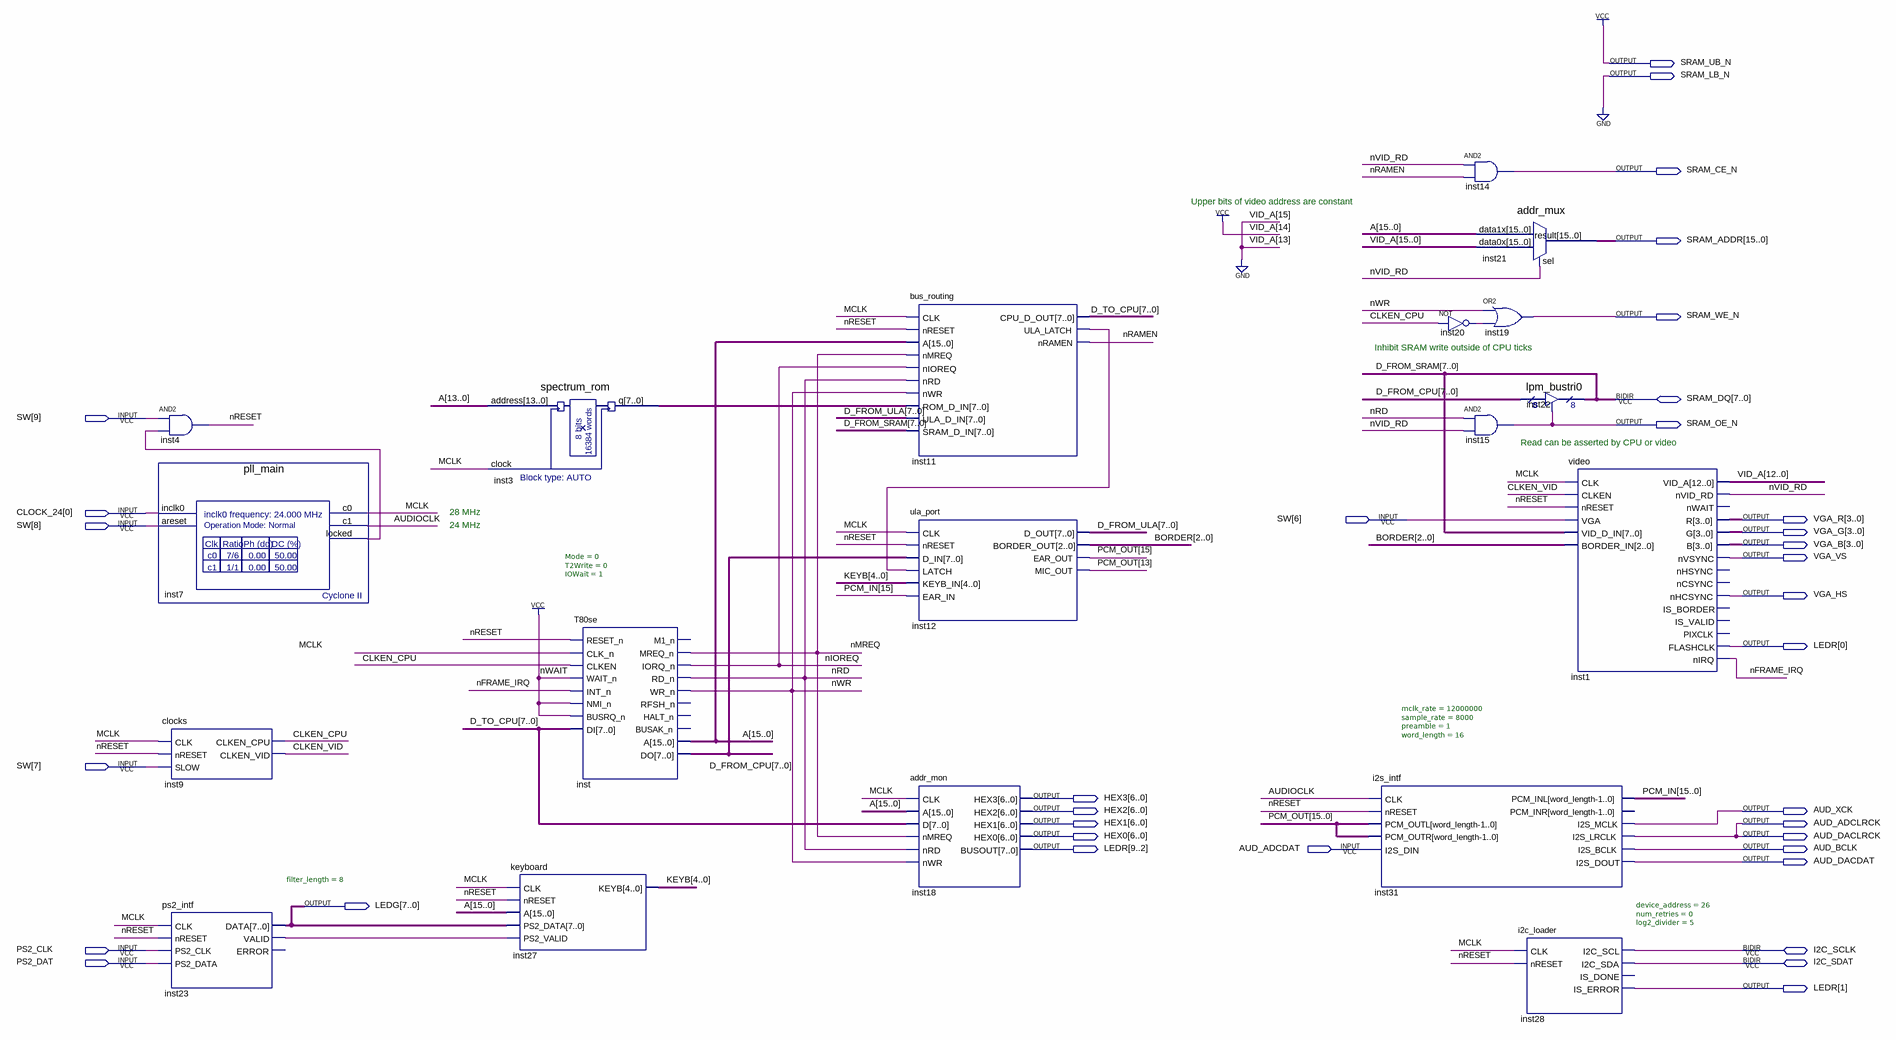
[diagram p0: schematic sheet]
// Quartus schematic spectrum.bdf as structural Verilog: 19 symbols, 35 pins
module spectrum (
  input  [9:6] SW,
  input  [0:0] CLOCK_24,
  input  AUD_ADCDAT,
  input  PS2_CLK,
  input  PS2_DAT,
  inout  [7:0] SRAM_DQ,
  inout  I2C_SCLK,
  inout  I2C_SDAT,
  output SRAM_UB_N,
  output SRAM_LB_N,
  output SRAM_CE_N,
  output [15:0] SRAM_ADDR,
  output SRAM_WE_N,
  output SRAM_OE_N,
  output [3:0] VGA_R,
  output [3:0] VGA_G,
  output [3:0] VGA_B,
  output VGA_VS,
  output VGA_HS,
  output [9:0] LEDR,
  output [6:0] HEX3,
  output [6:0] HEX2,
  output AUD_XCK,
  output [6:0] HEX1,
  output AUD_ADCLRCK,
  output [6:0] HEX0,
  output AUD_DACLRCK,
  output AUD_BCLK,
  output AUD_DACDAT,
  output [7:0] LEDG
);

  wire AUDIOCLK, CLKEN_CPU, CLKEN_VID, inst7_locked, inst11_ula_latch, inst20_out, inst23_valid, MCLK,
       nFRAME_IRQ, nIOREQ, nMREQ, nRAMEN, nRD, nRESET, nVID_RD, nWR;
  wire [2:0] BORDER;
  wire [4:0] KEYB;
  wire [7:0] D_FROM_CPU, D_FROM_ULA, D_TO_CPU, inst3_q;
  wire [12:0] VID_A;
  wire [15:0] A, PCM_IN, PCM_OUT;

  and inst4 (nRESET, SW[9], inst7_locked);
  pll_main inst7 (.inclk0(CLOCK_24[0]), .areset(SW[8]), .c0(MCLK), .c1(AUDIOCLK), .locked(inst7_locked));
  clocks inst9 (.CLK(MCLK), .nRESET(nRESET), .SLOW(SW[7]), .CLKEN_CPU(CLKEN_CPU), .CLKEN_VID(CLKEN_VID));
  ps2_intf #(.filter_length(8)) inst23 (
    .CLK(MCLK), .nRESET(nRESET), .PS2_CLK(PS2_CLK), .PS2_DATA(PS2_DAT), .DATA(LEDG), .VALID(inst23_valid));  // open: ERROR
  spectrum_rom inst3 (.address(A[13:0]), .clock(MCLK), .q(inst3_q));
  keyboard inst27 (.CLK(MCLK), .nRESET(nRESET), .A(A), .PS2_DATA(LEDG), .PS2_VALID(inst23_valid), .KEYB(KEYB));
  T80se #(.Mode(0), .T2Write(0), .IOWait(1)) inst (
    .RESET_n(nRESET), .CLK_n(MCLK), .CLKEN(CLKEN_CPU), .WAIT_n(1'b1), .INT_n(nFRAME_IRQ), .NMI_n(1'b1),
    .BUSRQ_n(1'b1), .DI(D_TO_CPU), .MREQ_n(nMREQ), .IORQ_n(nIOREQ), .RD_n(nRD), .WR_n(nWR), .A(A),
    .DO(D_FROM_CPU));  // open: M1_n, RFSH_n, HALT_n, BUSAK_n
  bus_routing inst11 (
    .CLK(MCLK), .nRESET(nRESET), .A(A), .nMREQ(nMREQ), .nIOREQ(nIOREQ), .nRD(nRD), .nWR(nWR),
    .ROM_D_IN(inst3_q), .ULA_D_IN(D_FROM_ULA), .SRAM_D_IN(SRAM_DQ), .CPU_D_OUT(D_TO_CPU),
    .ULA_LATCH(inst11_ula_latch), .nRAMEN(nRAMEN));
  ula_port inst12 (
    .CLK(MCLK), .nRESET(nRESET), .D_IN(D_FROM_CPU), .LATCH(inst11_ula_latch), .KEYB_IN(KEYB),
    .EAR_IN(PCM_IN[15]), .D_OUT(D_FROM_ULA), .BORDER_OUT(BORDER), .EAR_OUT(PCM_OUT[15]), .MIC_OUT(PCM_OUT[13]));
  addr_mon inst18 (
    .CLK(MCLK), .A(A), .D(D_TO_CPU), .nMREQ(nMREQ), .nRD(nRD), .nWR(nWR), .HEX3(HEX3), .HEX2(HEX2),
    .HEX1(HEX1), .HEX0(HEX0), .BUSOUT(LEDR[9:2]));
  i2s_intf #(.mclk_rate(12000000), .sample_rate(8000), .preamble(1), .word_length(16)) inst31 (
    .CLK(AUDIOCLK), .nRESET(nRESET), .PCM_OUTL(PCM_OUT), .PCM_OUTR(PCM_OUT), .I2S_DIN(AUD_ADCDAT),
    .PCM_INL(PCM_IN), .I2S_MCLK(AUD_XCK), .I2S_LRCLK(AUD_ADCLRCK), .I2S_BCLK(AUD_BCLK), .I2S_DOUT(AUD_DACDAT));  // open: PCM_INR
  and inst14 (SRAM_CE_N, nVID_RD, nRAMEN);
  addr_mux inst21 (.data1x(A), .data0x({3'b010, VID_A}), .sel(nVID_RD), .result(SRAM_ADDR));
  not inst20 (inst20_out, CLKEN_CPU);
  and inst15 (SRAM_OE_N, nRD, nVID_RD);
  or inst19 (SRAM_WE_N, nWR, inst20_out);
  lpm_bustri0 inst22 (.enabledt(SRAM_OE_N), .data(D_FROM_CPU), .tridata(SRAM_DQ));
  i2c_loader #(.device_address(26), .num_retries(0), .log2_divider(5)) inst28 (
    .CLK(MCLK), .nRESET(nRESET), .IS_ERROR(LEDR[1]), .I2C_SCL(I2C_SCLK), .I2C_SDA(I2C_SDAT));  // open: IS_DONE
  video inst1 (
    .CLK(MCLK), .CLKEN(CLKEN_VID), .nRESET(nRESET), .VGA(SW[6]), .VID_D_IN(SRAM_DQ), .BORDER_IN(BORDER),
    .VID_A(VID_A), .nVID_RD(nVID_RD), .R(VGA_R), .G(VGA_G), .B(VGA_B), .nVSYNC(VGA_VS), .nHCSYNC(VGA_HS),
    .FLASHCLK(LEDR[0]), .nIRQ(nFRAME_IRQ));  // open: nWAIT, nHSYNC, nCSYNC, IS_BORDER, IS_VALID, PIXCLK

  assign AUD_DACLRCK = AUD_ADCLRCK;
  assign SRAM_LB_N = 1'b0;
  assign SRAM_UB_N = 1'b1;

  // Other names for the same wires on the sheet: D_FROM_SRAM[7:0] = SRAM_DQ

  // Notes on the sheet:
  //   Upper bits of video address are constant
  //   Inhibit SRAM write outside of CPU ticks
  //   Read can be asserted by CPU or video
  //   28 MHz
  //   24 MHz
endmodule
